# Altium schematic sheet Batteries.SchDoc
size A; SheetNumber: 1; SheetTotal: 5; SPICEModelCacheOUMKRGKS: <root> / <DocumentId>OUMKRGKS</DocumentId> / </root>
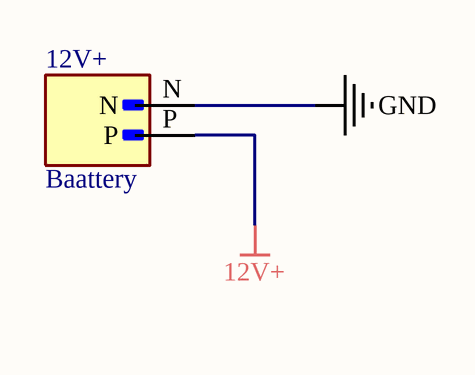
[diagram p0: Batteries.SchDoc]

## Parts
12V+  Baattery  [AMASS_XT30UPB-M]

## Nets
12V+: 12V+.P
GND: 12V+.N

## Library data of the parts
12V+ = XT30UPB-M: Socket; DC supply; XT30; male; PIN: 2; on PCBs; THT; yellow; 15A; 500V; MF: amass; SnapEDA_Link: https://www.snapeda.com/parts/XT30UPB-M/AMASS/view-part/?ref=snap; Package: None; Value: *; MP: XT30UPB-M; Check_prices: https://www.snapeda.com/parts/XT30UPB-M/AMASS/view-part/?ref=eda